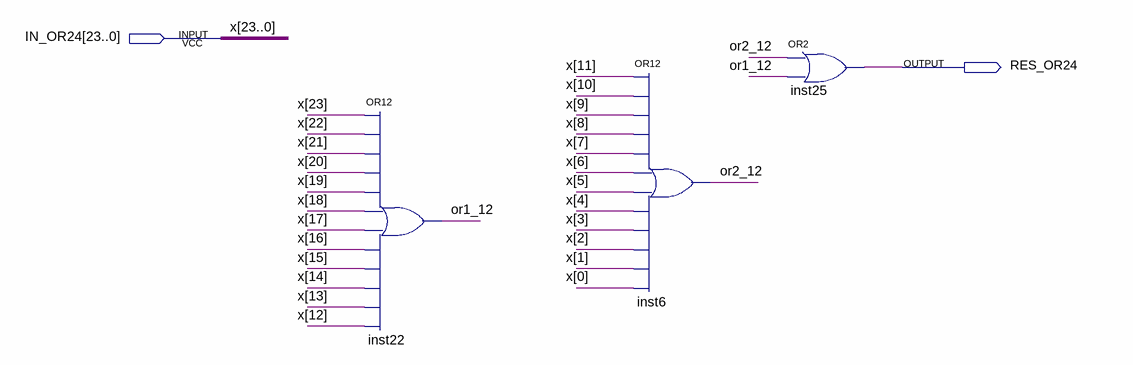
[diagram p0: schematic sheet]
// Quartus schematic My_OR24.bdf as structural Verilog: 3 symbols, 2 pins
module My_OR24 (
  input  [23:0] IN_OR24,
  output RES_OR24
);

  wire or1_12, or2_12;

  or inst22 (or1_12, IN_OR24[23], IN_OR24[22], IN_OR24[21], IN_OR24[20], IN_OR24[19], IN_OR24[18], IN_OR24[17], IN_OR24[16], IN_OR24[15], IN_OR24[14], IN_OR24[13], IN_OR24[12]);
  or inst6 (or2_12, IN_OR24[11], IN_OR24[10], IN_OR24[9], IN_OR24[8], IN_OR24[7], IN_OR24[6], IN_OR24[5], IN_OR24[4], IN_OR24[3], IN_OR24[2], IN_OR24[1], IN_OR24[0]);
  or inst25 (RES_OR24, or2_12, or1_12);

  // Other names for the same wires on the sheet: x[23:0] = IN_OR24
endmodule
